# EAGLE design ESP+L293D (EAGLE 9.6.2)
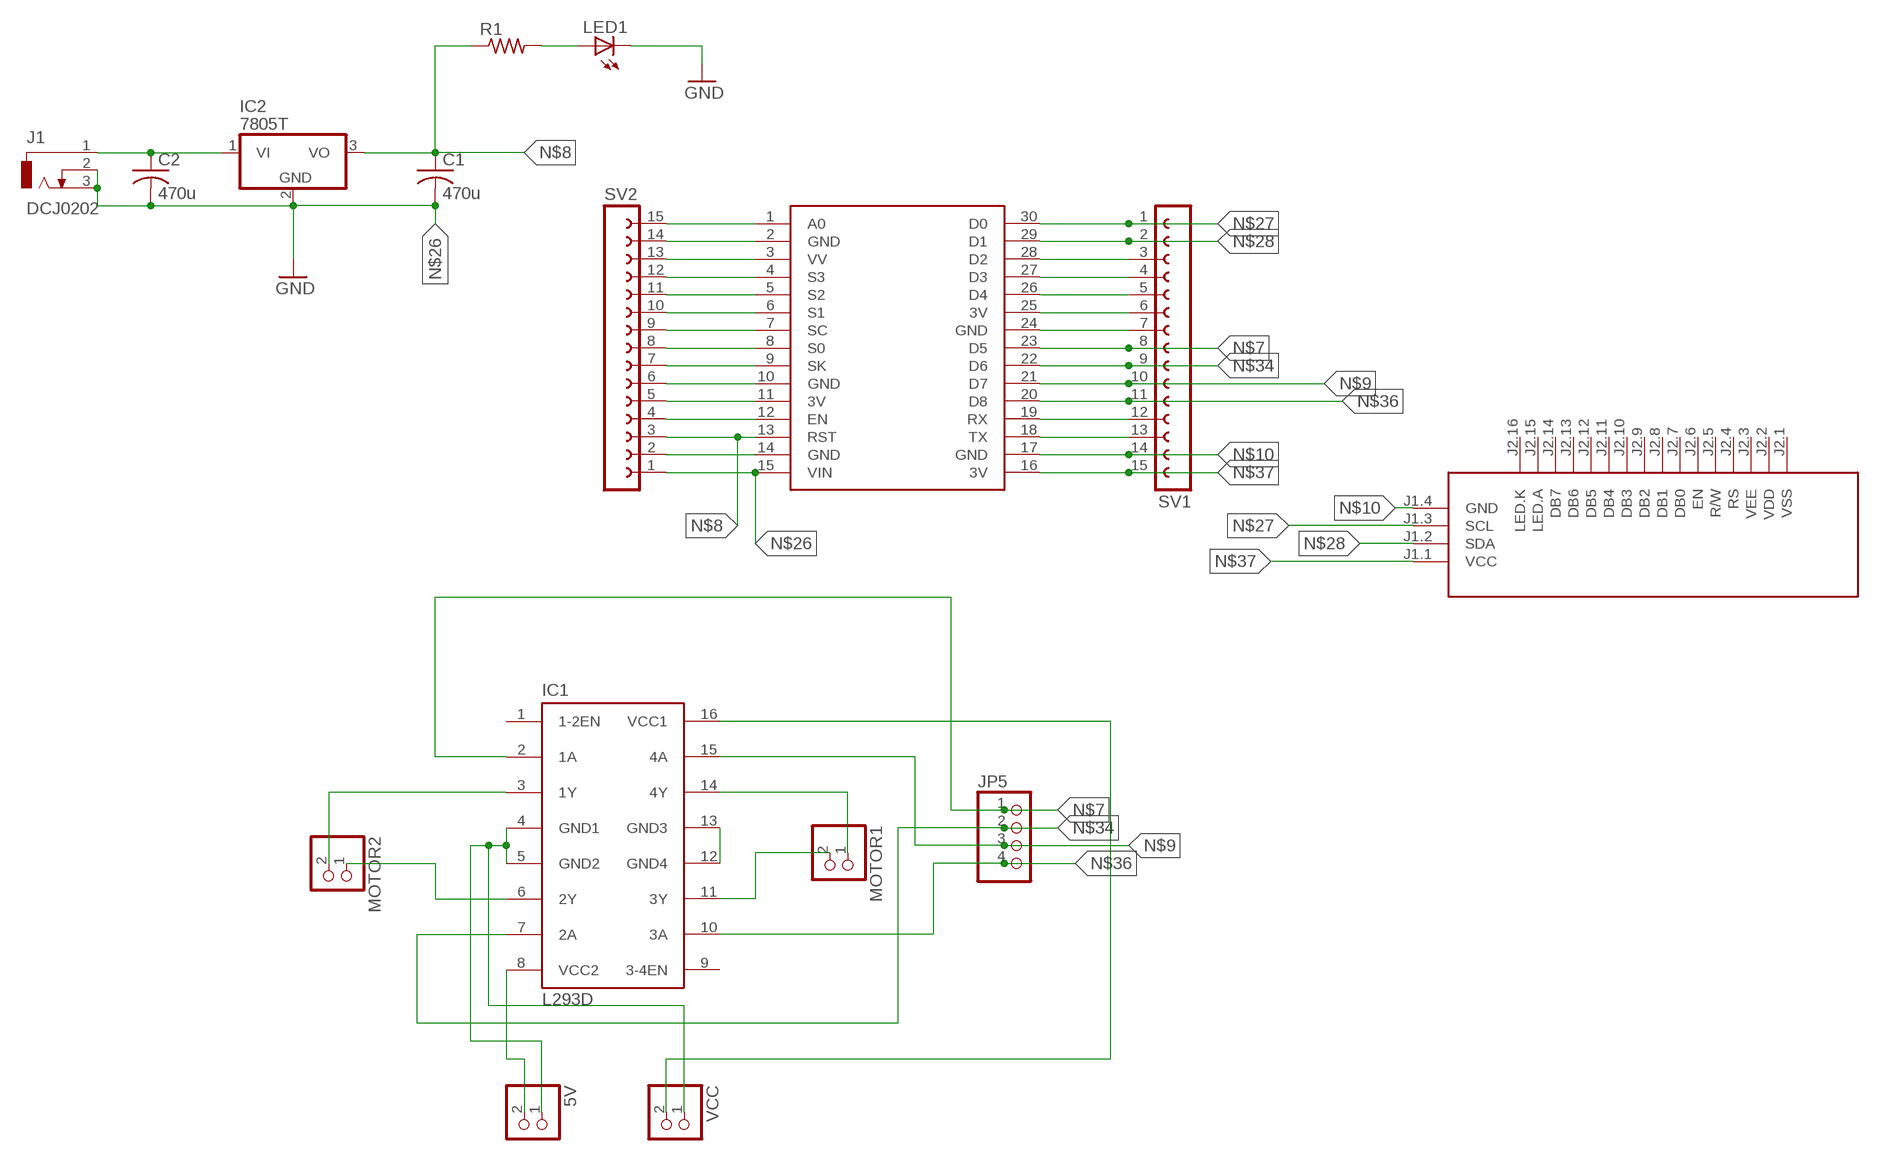
[diagram p0: schematic, sheet 1]

## Parts
5V  PINHD-1X2  [1X02]
C1  470u  C-US025-024X044  [C025-024X044]
C2  470u  C-US025-024X044  [C025-024X044]
IC1  L293D  [DIL16]
IC2  7805T  [TO220H]
J1  DCJ0202  [DCJ0202]
JP5  PINHD-1X4  [1X04]
LED1  LEDLD260  [LD260]
MOTOR1  PINHD-1X2  [1X02]
MOTOR2  PINHD-1X2  [1X02]
R1  R-US_0204/5  [0204/5]
SV1  FE15-1  [FE15]
SV2  FE15-1  [FE15]
U$1  NODEMCU  [NODEMCU]
U$2  LCD-I2C-CONVERTER  [LCD-I2C-CONVERTER]
VCC  PINHD-1X2  [1X02]

## Nets
GND: LED1.K(C)
N$1: IC1.3(1Y) MOTOR2.2
N$2: IC1.6(2Y) MOTOR2.1
N$3: IC1.14(4Y) MOTOR1.1
N$4: IC1.11(3Y) MOTOR1.2
N$5: 5V.1 IC1.4(GND1) IC1.5(GND2) VCC.1
N$6: IC1.12(GND4) IC1.13(GND3)
N$7: IC1.2(1A) JP5.1 SV1.8 U$1.23(D5)
N$8: C1.1 IC2.3(VO) R1.1 SV2.3 U$1.13(RST)
N$9: IC1.15(4A) JP5.3 SV1.10 U$1.21(D7)
N$10: SV1.14 U$1.17(GND) U$2.J1.4(GND)
N$11: 5V.2 IC1.8(VCC2)
N$12: IC1.16(VCC1) VCC.2
N$13: SV2.15 U$1.1(A0)
N$14: SV2.14 U$1.2(GND)
N$15: SV2.13 U$1.3(VV)
N$16: SV2.12 U$1.4(S3)
N$17: SV2.11 U$1.5(S2)
N$18: SV2.10 U$1.6(S1)
N$19: SV2.9 U$1.7(SC)
N$20: SV2.8 U$1.8(S0)
N$21: SV2.7 U$1.9(SK)
N$22: SV2.6 U$1.10(GND)
N$23: SV2.5 U$1.11(3V)
N$24: SV2.4 U$1.12(EN)
N$25: SV2.2 U$1.14(GND)
N$26: C1.2 C2.2 IC2.2(GND) J1.2 J1.3 SV2.1 U$1.15(VIN) ; supply symbol labelled GND
N$27: SV1.1 U$1.30(D0) U$2.J1.3(SCL)
N$28: SV1.2 U$1.29(D1) U$2.J1.2(SDA)
N$29: SV1.3 U$1.28(D2)
N$30: SV1.4 U$1.27(D3)
N$31: SV1.5 U$1.26(D4)
N$32: SV1.6 U$1.25(3V)
N$33: SV1.7 U$1.24(GND)
N$34: IC1.7(2A) JP5.2 SV1.9 U$1.22(D6)
N$36: IC1.10(3A) JP5.4 SV1.11 U$1.20(D8)
N$37: SV1.15 U$1.16(3V) U$2.J1.1(VCC)
N$38: SV1.12 U$1.19(RX)
N$39: SV1.13 U$1.18(TX)
N$42: C2.1 IC2.1(VI) J1.1
N$43: LED1.A R1.2
Unconnected: IC1.1(1-2EN) IC1.9(3-4EN) U$2.J2.1(VSS) U$2.J2.2(VDD) U$2.J2.3(VEE) U$2.J2.4(RS) U$2.J2.5(R/W) U$2.J2.6(EN) U$2.J2.7(DB0) U$2.J2.8(DB1) U$2.J2.9(DB2) U$2.J2.10(DB3) U$2.J2.11(DB4) U$2.J2.12(DB5) U$2.J2.13(DB6) U$2.J2.14(DB7) U$2.J2.15(LED.A) U$2.J2.16(LED.K)

## Library data of the parts
5V MOTOR1 MOTOR2 VCC = pinhead:PINHD-1X2: PIN HEADER
C1 C2 = rcl:C-US: CAPACITOR, American symbol; SPICEPREFIX: C
IC1 = st-microelectronics:L293D: PUSH-PULL 4 CHANNEL DRIVER; MPN: L293D; OC_FARNELL: 9589619; OC_NEWARK: 56P8249
IC2 = linear:78*: Positive VOLTAGE REGULATOR Source: http://cache.national.com/ds/LM/LM78L05.pdf http://www.fairchildsemi.com/ds/LM/LM7805.pdf
J1 = con-jack:DCJ0202: DC POWER JACK Source: DCJ0202.pdf; OC_FARNELL: unknown; OC_NEWARK: unknown
JP5 = pinhead:PINHD-1X4: PIN HEADER
LED1 = adafruit:LED: LED OSRAM: - CHIPLED LG R971, LG N971, LY N971, LG Q971, LY Q971, LO R971, LY R971 LH N974, LH R974 LS Q976, LO Q976, LY Q976 LO Q996 - Hyper CHIPLED LW Q18S LB Q993, LB Q99A, LB R99A - SideLED LS A670, LO A670, LY A670, LG A670, LP A670 LB A673, LV A673, LT A673, LW A673 LH A674 LY A675 LS A676, LA A676, LO A676, LY A676, LW A676 LS A679, LY A679, LG A679 - Hyper Micro SIDELED® LS Y876, LA Y876, LO Y876, LY Y876 LT Y87S - SmartLED LW L88C, LW L88S LB L89C, LB L89S, LG L890 LS L89K, LO L89K, LY L89K LS L896, LA L896, LO L896, LY L896 - TOPLED LS T670, LO T670, LY T670, LG T670, LP T670 LSG T670, LSP T670, LSY T670, LOP T670, LYG T670 LG T671, LOG T671, LSG T671 LB T673, LV T673, LT T673, LW T673 LH T674 LS T676, LA T676, LO T676, LY T676, LB T676, LH T676, LSB T676, LW T676 LB T67C, LV T67C, LT T67C, LS T67K, LO T67K, LY T67K, LW E67C LS E67B, LA E67B, LO E67B, LY E67B, LB E67C, LV E67C, LT E67C LW T67C LS T679, LY T679, LG T679 LS T770, LO T770, LY T770, LG T770, LP T770 LB T773, LV T773, LT T773, LW T773 LH T774 LS E675, LA E675, LY E675, LS T675 LS T776, LA T776, LO T776, LY T776, LB T776 LHGB T686 LT T68C, LB T68C - Hyper Mini TOPLED® LB M676 - Mini TOPLED Santana® LG M470 LS M47K, LO M47K, LY M47K Source: http://www.osram.convergy.de/
R1 = adafruit:R-US_: RESISTOR, American symbol
SV1 SV2 = con-lsta:FE15-1: FEMALE HEADER; OC_FARNELL: unknown; OC_NEWARK: unknown
U$1 = nodemcu:NODEMCU
U$2 = diy-modules:LCD-I2C-CONVERTER: I2C Bus to 4-Bit Parallel LCD Interface with LED backlight driver

## Net classes
0 default: width 0.305 mm, drill 0.508 mm, clearance 0.254 mm

## Board
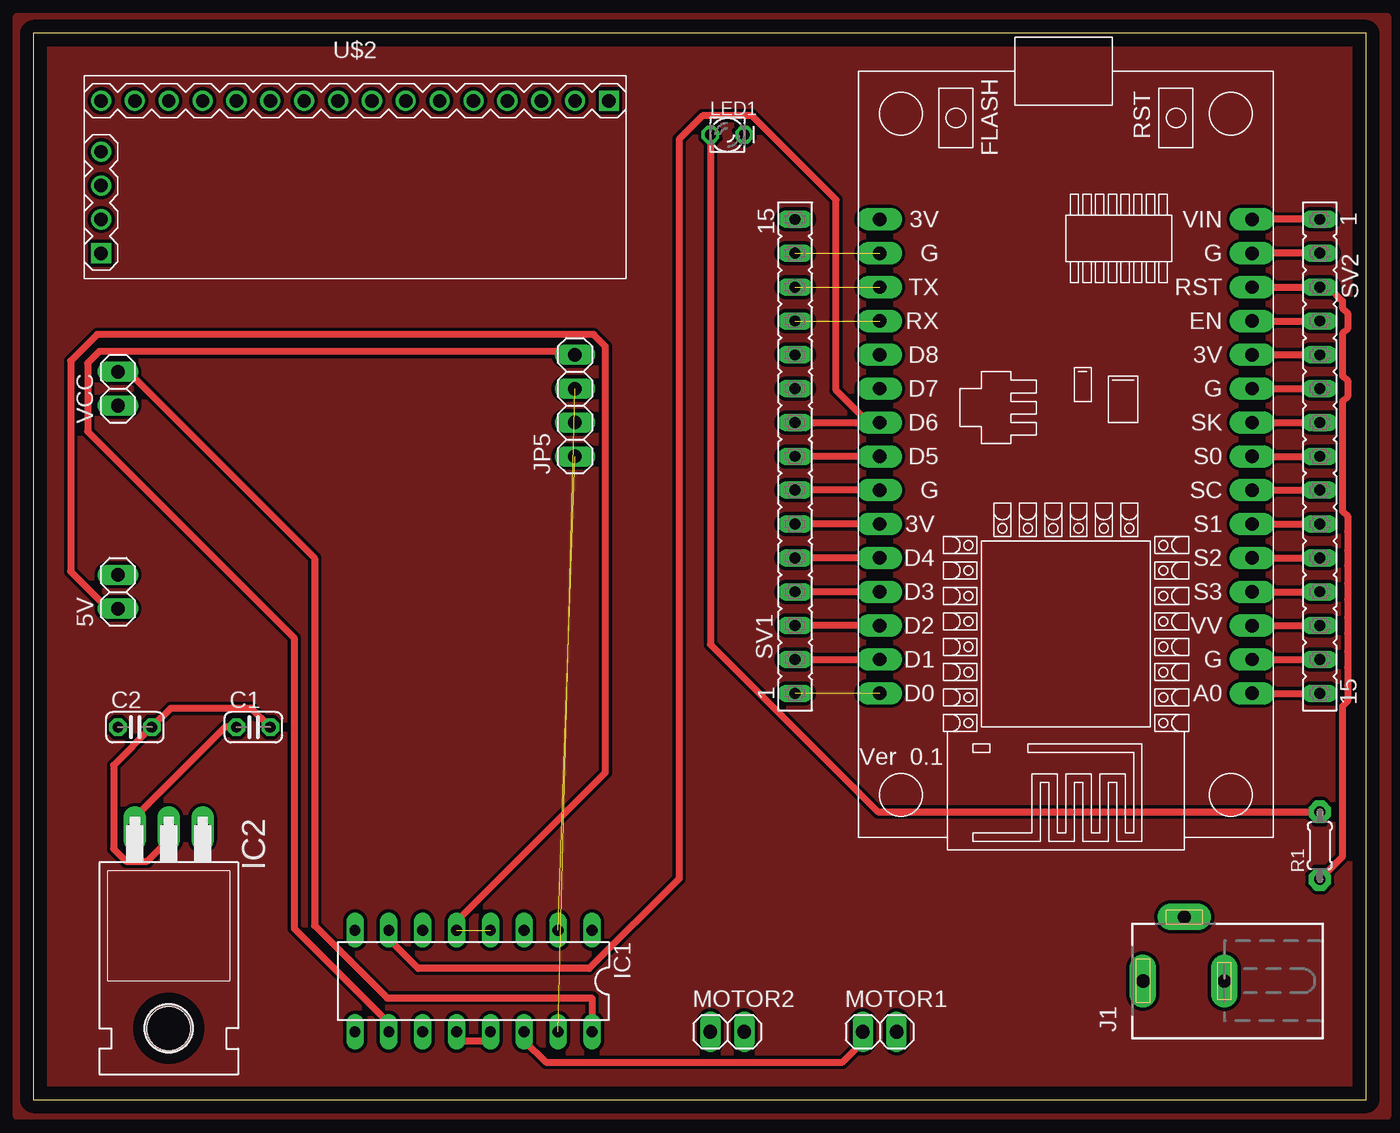
[diagram p1: board, top side]
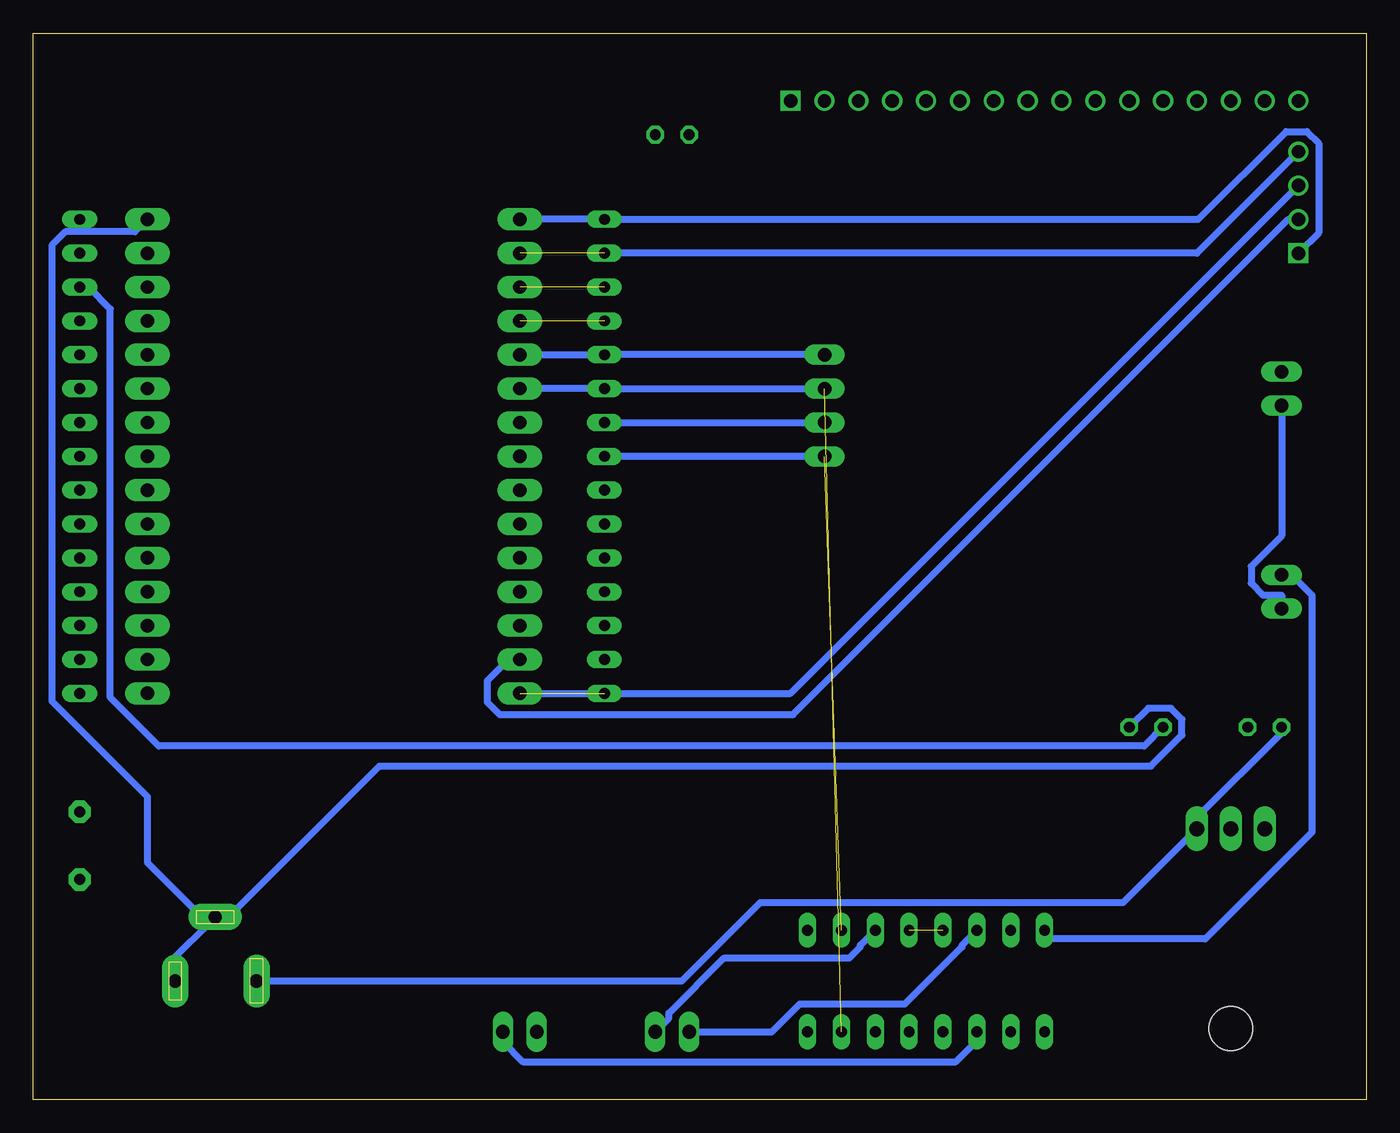
[diagram p2: board, bottom side, seen from below]

Size 100 x 80 mm. Coordinates in mm from the lower left corner, seen from the top.
Outline: 0,0 100,0 100,80 0,80 0,0
Copper layers (1*16): Top 0.035mm / dielectric 1.5mm / Bottom 0.035mm
Design rules "default": minimum track width 6mil, minimum drill 0.35mm, track to track 6mil, track to pad 6mil, pad to pad 6mil, via to via 6mil, smd to smd 6mil, copper to edge 40mil, drill to drill 6mil, minimum pad ring 10mil, minimum via ring 8mil, stop-mask expansion 4mil, vias tented up to drill 0mil, thermal gap 10mil

### Footprints (pad centres in the part's own frame; a part is rotated, then mirrored left to right if it is on the bottom)
1X02 = drill 1.016 long: 1 -1.27,0; 2 1.27,0
C025-024X044 = drill 0.813 octagon: 1 -1.27,0; 2 1.27,0
DIL16 = drill 0.813 long: 1 -8.89,-3.81; 2 -6.35,-3.81; 3 -3.81,-3.81; 4 -1.27,-3.81; 5 1.27,-3.81; 6 3.81,-3.81; 7 6.35,-3.81; 8 8.89,-3.81; 9 8.89,3.81; 10 6.35,3.81; 11 3.81,3.81; 12 1.27,3.81; 13 -1.27,3.81; 14 -3.81,3.81; 15 -6.35,3.81; 16 -8.89,3.81
TO220H = drill 1.118 long: 1 -2.54,-10.16; 2 0,-10.16; 3 2.54,-10.16 | hole 3.302: 0,4.826
DCJ0202 = drill 1 pad 2 long: 1 0,3.1; 2 4.8,0; 3 0,-3
1X04 = drill 1.016 long: 1 -3.81,0; 2 -1.27,0; 3 1.27,0; 4 3.81,0
LD260 = drill 0.813 octagon: A -1.27,0; K 1.27,0
0204/5 = drill 0.813 pad 1.676 octagon: 1 -2.54,0; 2 2.54,0
FE15 = drill 0.813 long: 1 -17.78,0; 2 -15.24,0; 3 -12.7,0; 4 -10.16,0; 5 -7.62,0; 6 -5.08,0; 7 -2.54,0; 8 0,0; 9 2.54,0; 10 5.08,0; 11 7.62,0; 12 10.16,0; 13 12.7,0; 14 15.24,0; 15 17.78,0
NODEMCU = drill 1 pad 1.676 long: 1 -13.97,17.78; 2 -13.97,15.24; 3 -13.97,12.7; 4 -13.97,10.16; 5 -13.97,7.62; 6 -13.97,5.08; 7 -13.97,2.54; 8 -13.97,0; 9 -13.97,-2.54; 10 -13.97,-5.08; 11 -13.97,-7.62; 12 -13.97,-10.16; 13 -13.97,-12.7; 14 -13.97,-15.24; 15 -13.97,-17.78; 16 13.97,-17.78; 17 13.97,-15.24; 18 13.97,-12.7; 19 13.97,-10.16; 20 13.97,-7.62; 21 13.97,-5.08; 22 13.97,-2.54; 23 13.97,0; 24 13.97,2.54; 25 13.97,5.08; 26 13.97,7.62; 27 13.97,10.16; 28 13.97,12.7; 29 13.97,15.24; 30 13.97,17.78
LCD-I2C-CONVERTER = drill 1 square: J1.1 -19.05,-5.08; J2.1 19.05,6.35 | drill 1: J1.2 -19.05,-2.54; J1.3 -19.05,0; J1.4 -19.05,2.54; J2.2 16.51,6.35; J2.3 13.97,6.35; J2.4 11.43,6.35; J2.5 8.89,6.35; J2.6 6.35,6.35; J2.7 3.81,6.35; J2.8 1.27,6.35; J2.9 -1.27,6.35; J2.10 -3.81,6.35; J2.11 -6.35,6.35; J2.12 -8.89,6.35; J2.13 -11.43,6.35; J2.14 -13.97,6.35; J2.15 -16.51,6.35; J2.16 -19.05,6.35

### Placement (x,y rotation side)
5V  6.35,38.1 90 top
C1  16.51,27.94 0 top
C2  7.62,27.94 0 top
IC1  33.02,8.89 180 top
IC2  10.16,10.16 180 top
J1  86.36,8.89 90 top
JP5  40.64,52.07 90 top
LED1  52.07,72.39 0 top
MOTOR1  63.5,5.08 0 top
MOTOR2  52.07,5.08 0 top
R1  96.52,19.05 90 top
SV1  57.15,48.26 90 top
SV2  96.52,48.26 270 top
U$1  77.47,48.26 180 top
U$2  24.13,68.58 0 top
VCC  6.35,53.34 90 top

### Tracks (layer width: path | path; a pad name or v marks a point on that pad's centre or on a via)
N$1
  Bottom 0.508: MOTOR2.2 52.32,6.1 52.32,6.47 48.18,10.62 38.78,10.62 37.95,11.45 37.95,11.58 IC1.3
N$2
  Bottom 0.508: IC1.6 30.33,11.58 30.33,11.45 34.62,7.16 42.5,7.16 44.58,5.08 MOTOR2.1
N$3
  Top 0.508: IC1.14 36.83,4.42 38.46,2.79 60.71,2.79 62.23,4.32 MOTOR1.1
N$4
  Bottom 0.508: IC1.11 29.21,4.42 30.84,2.79 63.25,2.79 64.77,4.32 MOTOR1.2
N$5  (1 unrouted)
  Top 0.508: IC1.5 31.75,13.36 42.93,24.54 42.93,56.51 42.03,57.4 4.79,57.4 2.79,55.41 2.79,39.62 5.59,36.83 5V.1
  Bottom 0.508: VCC.1 6.35,42.29 8.64,40 8.64,38.74 7.74,37.85 6.35,37.85 5V.1
N$6
  Top 0.508: IC1.12 31.75,4.42 34.29,4.42 IC1.13
N$7  (1 unrouted)
  Top 0.508: U$1.23 62.66,48.26 57.81,48.26 SV1.8
  Bottom 0.508: JP5.1 SV1.8
N$8
  Top 0.508: R1.1 98.22,18.21 98.22,29.51 98.6,29.89 98.6,31.07 98.6,32.43 98.6,33.61 98.6,34.97 98.6,36.15 98.6,37.51 98.6,38.69 98.6,40.05 98.6,41.23 98.6,42.59 98.6,43.77 98.22,44.15 98.22,52.37 98.6,52.75 98.6,53.93 98.22,54.31 98.22,57.45 98.6,57.83 98.6,59.01 98.22,59.39 98.22,59.92 97.18,60.96 SV2.3 95.86,60.96 92.28,60.96 U$1.13 | C1.1 14.4,27.94 7.62,21.16 IC2.3
  Bottom 0.508: C1.1 16.66,26.52 90.58,26.52 94.22,30.16 94.22,59.32 95.86,60.96 SV2.3
N$9  (1 unrouted)
  Bottom 0.508: U$1.21 SV1.10 JP5.3
N$10  (1 unrouted)
  Bottom 0.508: U$2.J1.4 12.7,63.5 SV1.14
N$11
  Bottom 0.508: 5V.2 5.59,39.37 4.06,37.85 4.06,20.05 12.07,12.04 24.13,12.04 IC1.8
N$12
  Top 0.508: VCC.2 7.11,54.61 21.09,40.63 21.09,13.07 26.54,7.62 41.91,7.62 41.91,5.74 IC1.16
N$13
  Top 0.508: U$1.1 92.28,30.48 95.86,30.48 SV2.15
N$14
  Top 0.508: U$1.2 92.28,33.02 95.86,33.02 SV2.14
N$15
  Top 0.508: U$1.3 92.28,35.56 95.86,35.56 SV2.13
N$16
  Top 0.508: U$1.4 92.28,38.1 95.86,38.1 SV2.12
N$17
  Top 0.508: U$1.5 92.28,40.64 95.86,40.64 SV2.11
N$18
  Top 0.508: U$1.6 92.28,43.18 95.86,43.18 SV2.10
N$19
  Top 0.508: U$1.7 92.28,45.72 95.86,45.72 SV2.9
N$20
  Top 0.508: U$1.8 92.28,48.26 95.86,48.26 SV2.8
N$21
  Top 0.508: U$1.9 92.28,50.8 95.86,50.8 SV2.7
N$22
  Top 0.508: U$1.10 92.28,53.34 95.86,53.34 SV2.6
N$23
  Top 0.508: U$1.11 92.28,55.88 95.86,55.88 SV2.5
N$24
  Top 0.508: U$1.12 92.28,58.42 95.86,58.42 SV2.4
N$25
  Top 0.508: SV2.2 95.86,63.5 92.28,63.5 U$1.14
N$26
  Top 0.508: IC2.2 10.16,19.48 8.56,17.88 6.96,17.88 6.02,18.82 6.02,25.07 C2.2 10.31,29.36 16.36,29.36 C1.2 | SV2.1 U$1.15
  Bottom 0.508: 86.86,13.2 J1.2 85.36,13.69 74.02,25.03 16.14,25.03 13.82,27.35 13.82,28.53 14.65,29.36 16.36,29.36 C1.2 | 86.86,13.2 89.36,10.69 J1.3 | 86.86,13.2 91.44,17.78 91.44,22.73 98.6,29.89 98.6,64.09 97.59,65.1 92.38,65.1 U$1.15
N$27  (1 unrouted)
  Bottom 0.508: U$1.30 62.66,30.48 43.18,30.48 U$2.J1.3
N$28
  Top 0.508: SV1.2 57.81,33.02 62.66,33.02 U$1.29
  Bottom 0.508: U$1.29 64.34,33.02 65.94,31.42 65.94,29.82 65,28.88 42.99,28.88 5.83,66.04 U$2.J1.2
N$29
  Top 0.508: U$1.28 62.66,35.56 57.81,35.56 SV1.3
N$30
  Top 0.508: U$1.27 62.66,38.1 57.81,38.1 SV1.4
N$31
  Top 0.508: U$1.26 62.66,40.64 57.81,40.64 SV1.5
N$32
  Top 0.508: U$1.25 62.66,43.18 57.81,43.18 SV1.6
N$33
  Top 0.508: U$1.24 62.66,45.72 57.81,45.72 SV1.7
N$34
  Top 0.508: 62.66,50.8 U$1.22 62.66,50.8 | 62.66,50.8 60.24,53.23 60.24,67.5 53.93,73.81 50.21,73.81 48.45,72.05 48.45,16.57 41.71,9.83 28.88,9.83 26.67,12.04 IC1.7 | SV1.9 57.81,50.8 62.66,50.8
  Bottom 0.508: SV1.9 56.49,50.8 41.4,50.8 JP5.2
N$35
  pour Top: -1.27,81.28 101.6,81.28 101.6,-1.27 -1.27,-1.27
N$36
  Top 0.508: JP5.4 39.88,55.88 39.62,56.13 4.96,56.13 4.06,55.24 4.06,50.12 19.57,34.62 19.57,12.84 26.67,5.74 IC1.10
  Bottom 0.508: JP5.4 SV1.11 57.81,55.88 62.66,55.88 U$1.20
N$37
  Bottom 0.508: U$1.16 SV1.15 56.49,66.04 12.6,66.04 6.01,72.64 4.45,72.64 3.56,71.75 3.56,65.02 U$2.J1.1
N$38  (1 unrouted)
N$39  (1 unrouted)
N$42
  Bottom 0.508: J1.1 51.34,8.89 45.45,14.78 18.24,14.78 IC2.1 12.7,21.16 6.35,27.51 C2.1
N$43
  Top 0.508: LED1.A 50.8,34.16 63.37,21.59 R1.2